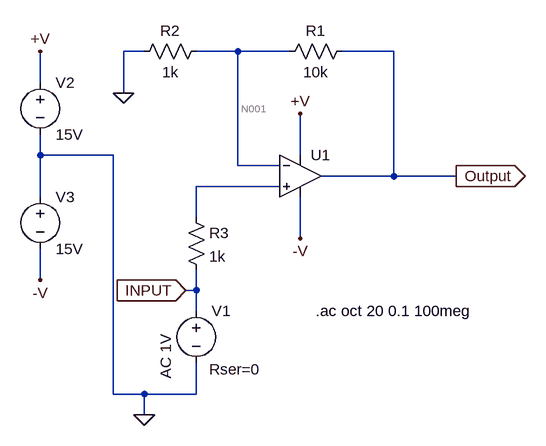
[diagram p0: schematic 25.1_7.(3)_non-inverting_0-impedance.asc]
25.1_7.(3)_non-inverting_0-impedance.asc, the LTspice schematic file:
Version 4
SHEET 1 880 680
WIRE 96 0 64 0
WIRE 240 0 176 0
WIRE 320 0 240 0
WIRE 480 0 400 0
WIRE -64 48 -64 0
WIRE 64 64 64 0
WIRE -64 160 -64 128
WIRE 48 160 -64 160
WIRE 336 160 336 96
WIRE 240 176 240 0
WIRE 304 176 240 176
WIRE 480 192 480 0
WIRE 480 192 368 192
WIRE 576 192 480 192
WIRE 304 208 176 208
WIRE -64 224 -64 160
WIRE 176 256 176 208
WIRE 336 288 336 224
WIRE -64 352 -64 304
WIRE 176 368 176 336
WIRE 176 368 160 368
WIRE 176 400 176 368
WIRE 48 528 48 160
WIRE 96 528 48 528
WIRE 176 528 176 480
WIRE 176 528 96 528
WIRE 96 560 96 528
FLAG 576 192 Output
IOPIN 576 192 Out
FLAG 96 560 0
FLAG -64 0 +V
FLAG 336 96 +V
FLAG -64 352 -V
FLAG 336 288 -V
FLAG 160 368 INPUT
IOPIN 160 368 In
FLAG 64 64 0
SYMBOL Opamps\\UniversalOpamp2 336 192 R0
SYMATTR InstName U1
SYMBOL voltage -64 32 R0
WINDOW 123 0 0 Left 2
WINDOW 39 0 0 Left 2
SYMATTR InstName V2
SYMATTR Value 15V
SYMBOL voltage -64 208 R0
WINDOW 123 0 0 Left 2
WINDOW 39 0 0 Left 2
SYMATTR InstName V3
SYMATTR Value 15V
SYMBOL voltage 176 384 R0
WINDOW 123 -47 121 VLeft 2
WINDOW 39 20 106 Left 2
SYMATTR Value2 AC 1V
SYMATTR SpiceLine Rser=0
SYMATTR InstName V1
SYMATTR Value ""
SYMBOL res 192 -16 R90
WINDOW 0 0 56 VBottom 2
WINDOW 3 32 56 VTop 2
SYMATTR InstName R2
SYMATTR Value 1k
SYMBOL res 160 240 R0
SYMATTR InstName R3
SYMATTR Value 1k
SYMBOL res 416 -16 R90
WINDOW 0 0 56 VBottom 2
WINDOW 3 32 56 VTop 2
SYMATTR InstName R1
SYMATTR Value 10k
TEXT 360 400 Left 2 !.ac oct 20 0.1 100meg

The netlist it stands for:
* 25.1_7.(3)_non-inverting_0-impedance.asc
XU1 N002 N001 +V -V Output level.2 Avol=1Meg GBW=10Meg Slew=10Meg ilimit=25m rail=0 Vos=0 phimargin=45 en=0 enk=0 in=0 ink=0 Rin=500Meg  ; pins IN+ IN- V+ V- OUT
V2 +V 0 15V
V3 0 -V 15V
V1 INPUT 0 AC 1V Rser=0
R2 N001 0 1k
R3 N002 INPUT 1k
R1 Output N001 10k
.ac oct 20 0.1 100meg
.lib UniversalOpamps2.sub
.backanno
.end

* Results of the author's LTspice run, read from the files saved beside the schematic
* Operating Point, zero values left out:
*   V(+v) = 15 V
*   V(-v) = -15 V
*   I(V3) = -1.498 mA
*   I(V2) = -1.498 mA
*   Ix(u1:3) = 1.498 mA
*   Ix(u1:4) = -1.498 mA
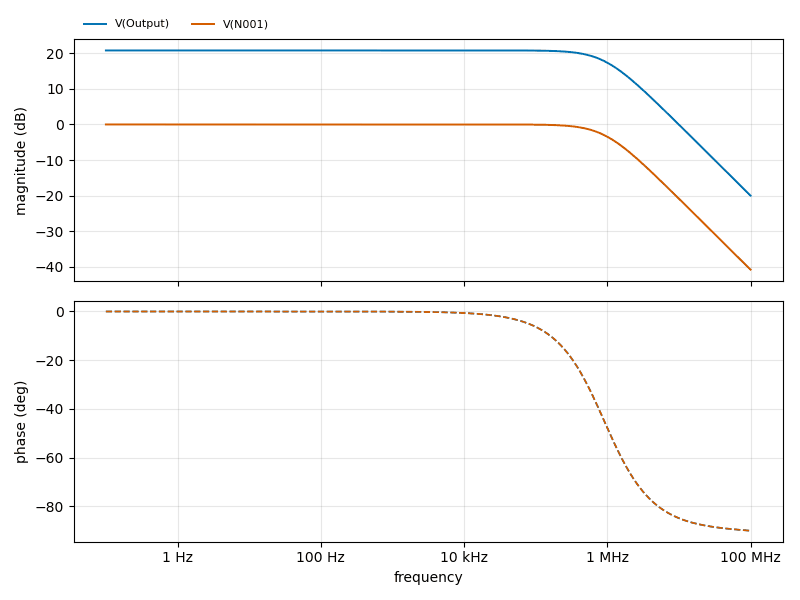
[diagram p1: AC Analysis of 25.1_7.(3)_non-inverting_0-impedance.asc, plotted from the saved traces]
* AC Analysis, 1 run:
*   V(Output): 20.83 dB at 100 mHz, -20.02 dB at 100 MHz, peak 20.83 dB at 100 mHz, 3 dB below the peak at 907.1 kHz
*   V(N001): -0.00 dB at 100 mHz, -40.85 dB at 100 MHz, peak -0.00 dB at 100 mHz, 3 dB below the peak at 907.1 kHz